# Altium project fNIRS_sensor_module.PrjPcb
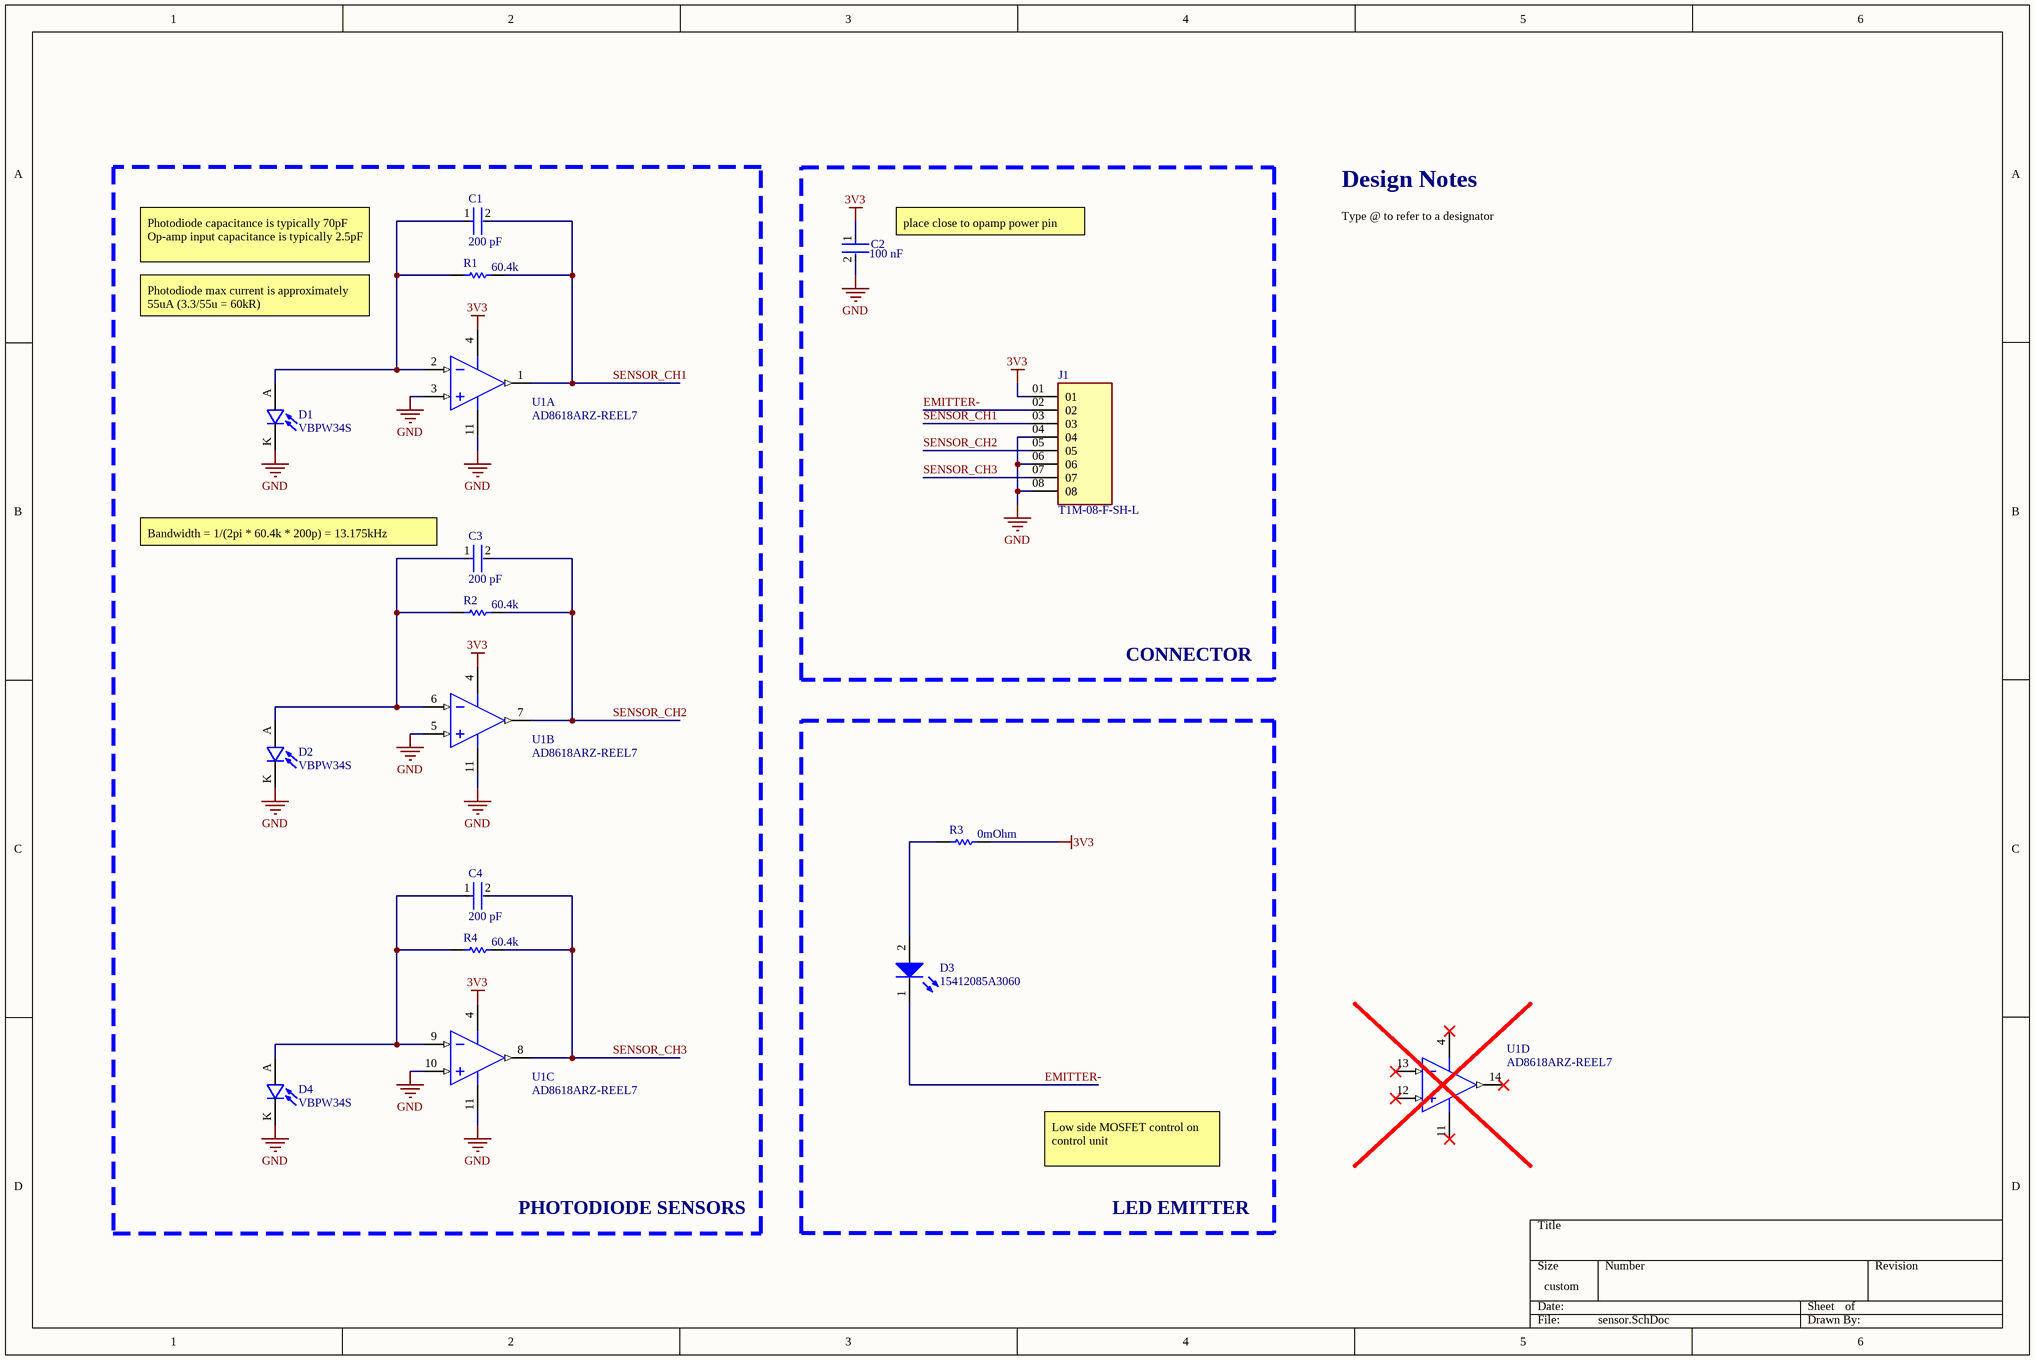
[diagram p0: sensor.SchDoc]
1 sheet, 14 parts. Net scope: global (net labels, ports and power ports of the same name join across sheets).
Board file: SensorModule.PcbDoc

## Sheet sensor.SchDoc
size 381 x 254 mm; SheetNumber: 1; SheetTotal: 1

### Parts
C1  Capacitance: 200 pF  [FP-C0603C-CF-MFG]  (hidden comment: C0603C201J5GACTU)
C2  Capacitance: 100 nF  [FP-CC0603-DA-MFG]  (hidden comment: CC0603KRX7R7BB104)
C3  Capacitance: 200 pF  [FP-C0603C-CF-MFG]  (hidden comment: C0603C201J5GACTU)
C4  Capacitance: 200 pF  [FP-C0603C-CF-MFG]  (hidden comment: C0603C201J5GACTU)
D1  VBPW34S  [XDCR_VBPW34S]
D2  VBPW34S  [XDCR_VBPW34S]
D3  15412085A3060  [WL-SIRW_1206]
D4  VBPW34S  [XDCR_VBPW34S]
J1  T1M-08-F-SH-L  [SAMTEC_T1M-08-F-SH-L]
R1  Resistance: 60.4k  [RESC1608X55X25ML10T15]  (hidden comment: RC0603FR-0760K4L)
R2  Resistance: 60.4k  [RESC1608X55X25ML10T15]  (hidden comment: RC0603FR-0760K4L)
R3  Resistance: 0mOhm  [RESC1608X55X25ML10T15]  (hidden comment: RC0603JR-070RL)
R4  Resistance: 60.4k  [RESC1608X55X25ML10T15]  (hidden comment: RC0603FR-0760K4L)
U1  AD8618ARZ-REEL7  [ADI-R-14_M]  (parts A,B,C,D of 4)

### Blocks framed on the sheet
PHOTODIODE SENSORS: C1 C3 C4 D1 D2 D4 R1 R2 R4 U1
CONNECTOR: C2 J1
LED EMITTER: D3 R3

### Nets
3V3: C2.1 J1.01 R3.2 U1.4(+V)
GND: C2.2 D1.K(C) D2.K(C) D4.K(C) J1.04 J1.06 J1.08 U1.3(+IN_A) U1.5(+IN_B) U1.10(+IN_C) U1.11(-V)
EMITTER-: D3.1(K) J1.02
SENSOR_CH1: C1.2 J1.03 R1.2 U1.1(OUT_A)
SENSOR_CH2: C3.2 J1.05 R2.2 U1.7(OUT_B)
SENSOR_CH3: C4.2 J1.07 R4.2 U1.8(OUT_C)
NetC1_1: C1.1 D1.A R1.1 U1.2(-IN_A)
NetC3_1: C3.1 D2.A R2.1 U1.6(-IN_B)
NetC4_1: C4.1 D4.A R4.1 U1.9(-IN_C)
NetD3_2: D3.2(A) R3.1

Not connected (* = marked no-connect by the designer): U1 12(+IN_D)* 13(-IN_D)* 14(OUT_D)*

### Notes on the sheet
- (near C2) place close to opamp power pin
- Design Notes
- Photodiode capacitance is typically 70pF
  Op-amp input capacitance is typically 2.5pF
- Photodiode max current is approximately 55uA (3.3/55u = 60kR)
- (near C3) Bandwidth = 1/(2pi * 60.4k * 200p) = 13.175kHz
- Type @ to refer to a designator
- Low side MOSFET control on control unit

### Library data of the parts
C1 C3 C4 = CMP-1035-01444-3: CAP CER 200PF 50V 5% NP0 0603; Manufacturer: KEMET; Automotive Grade: Grade 1; Temperature Characteristic: C0G; Temperature Coefficient: 30ppm/°C; Tolerance: 0.05; Material: Ceramic; Temperature Range High: +125°C; Digikey Description: CAP CER 200PF 50V 5% NP0 0603; ComponentLink2Description: Datasheet; Package: C0603C-CF; Value: 200 pF; Mouser Description: Multilayer Ceramic Capacitors MLCC - SMD/SMT 50volts 200pF C0G 5%; Voltage Rating: 50 V; Temperature Range Low: -55°C; Device Class L2: Capacitors; Temperature: -55°C to +125°C; Device Class L1: Passive Components; Device Class L3: Ceramic Capacitors; ComponentLink2URL: https://api.kemet.com/component-edge/download/datasheet/C0603C100J5GACAUTO.pdf; Height: 0.87mm; Automotive: Yes; Octopart: https://octopart.com/c0603c201j5gactu-kemet-9143917; Category: Cap; Manufacturer Part Number: C0603C201J5GACTU; Lead Free: Yes; RoHS: TRUE
C2 = CMP-2000-05002-2: CAP CER 0.1UF 16V X7R 0603; Manufacturer: YAGEO; Tolerance: 0.1; Value: 100 nF; Temperature Coefficient: 15%; Material: Ceramic; Voltage Rating: 16 V; Package: CC0603-DA; ComponentLink2Description: Datasheet; Octopart: https://octopart.com/cc0603krx7r7bb104-yageo-192941; Temperature Range High: +125°C; Digikey Description: CAP CER 0.1UF 16V X7R 0603; Voltage: 16 V; Device Class L2: Capacitors; Height: 0.9mm; Temperature: -55°C to +125°C; Manufacturer Part Number: CC0603KRX7R7BB104; Device Class L1: Passive Components; Device Class L3: Ceramic Capacitors; ComponentLink2URL: http://www.yageo.com/documents/recent/UPY-GPHC_X7R_6.3V-to-50V_18.pdf; Footprint Url: http://www.yageo.com/exep/pages/download/literatures/UPY-C_GEN_24.pdf; RoHS: TRUE; Temperature Range Low: -55°C; Temperature Characteristic: X7R; Lead Free: Yes; Category: Cap; Mouser Description: Multilayer Ceramic Capacitor, CC Series, 0.1 - F, - 10%, X7R, 16 V, 0603 [1608 Metric]; Automotive: No
D1 D2 D4 = VBPW34S: Photodiode 940nm 100ns 130Â° 2-SMD, Gull Wing; MF: Vishay; Price: None; MP: VBPW34S; Value: *; Package: SMD-2 Vishay; SnapEDA_Link: https://www.snapeda.com/parts/VBPW34S/Vishay%20Semiconductor%20Opto%20Division/view-part/139260/?ref=snap; Availability: Unavailable
D3 = CMP-03913-90235590-1: 15412085A3060 WL-SIRW SMT Infrared Reverse mount Waterclear Dome; Viewing Angle: 30°; Max Reverse Voltage (DC): 5V; Peak Wavelength: 850nm; Forward Current: 700mA; Forward Voltage: 1.4V; Peak Reverse Current: 10µA; Length: 3.2mm; Packaging: Tape and Reel; Min Operating Temperature: -40°C; Height: 1.85mm; RoHS: Compliant; Width: 1.6mm; NexarPartId: 90235590; Max Operating Temperature: 85°C; Wavelength: 850nm
J1 = T1M-08-F-SH-L: MF: Samtec Inc.; Price: None; Availability: Unavailable; Package: None; Value: *; MP: T1M-08-F-SH-L
R1 R2 R4 = CMP-2000-04099-1: Manufacturer: Yageo; Part Number: RC0603FR-0760K4L
R3 = CMP-2100-03667-1: Chip Resistor, 0 Ohm, +/- 5%, 0.1 W, -55 to 155 degC, 0603 (1608 Metric), RoHS, Tape and Reel; Manufacturer: Yageo; Temperature Coefficient: 200ppm/degreesC; Voltage Rating: 50V; Power Rating: 100mW; Width: 0.8mm; Max Operating Temperature: 155degC; Tolerance: 5%; Package Reference: 0603; Height: 0.45mm; Depth: 0.8mm; Package Description: 2-Pin Surface Mount Device, Body 1.6 x 0.8 mm; Termination: SMD/SMT; Package Quantity: 5000; Case/Package: 0603; Case Code (Imperial): 0603; Radiation Hardening: No; Number of Pins: 2; Length: 1.6mm; Lead Free: LeadFree; Voltage Rating (DC): 50V; Military Standard: Not; Datasheet URL: http://www.yageo.com/NewPortal/yageodocoutput?fileName=/pdf/R-Chip/PYu-RC_Group_51_RoHS_L_5.pdf; Manufacturer URL: http://www.yageo.com/; Packaging: TapeandReel; Case Code (Metric): 1608; Min Operating Temperature: -55degC; Composition: ThickFilm; RoHSCompliant: true; Contact Plating: Tin; Datasheet Version: Rev. 5, 10/2016; REACH SVHC: NoSVHC
U1 = CMP-0384-00392-1: Quad Channel Wide Bandwidth Operational Amplifier, 24 MHz BW, 12 V/us SR, Industrial, 14-pin SOIC (R-14), Reel; Generic Part Number: AD8618; Manufacturer: Analog Devices; Slew Rate: 12V/us; Small Signal Bandwidth: 24MHz; Amplifiers Per Package: 4; Input Offset Voltage: 23uV; Input Bias Current: 200fA; V Span Max: 6V; Iq/Amp: 2mA; V Span Min: 2.7V; ComponentLink2URL: http://www.analog.com/static/imported-files/data_sheets/AD8615_8616_8618.pdf; ComponentLink1URL: http://www.analog.com/en/index.html; PartNumber: AD8618ARZ-REEL7; Mounting Technology: Surface Mount; PackageReference: R-14; PackageVersion: 060606-A; ComponentLink3URL: http://www.analog.com/static/imported-files/packages/PKG_PDF/SOIC_Narrow%20(R)/R_14.pdf; DatasheetVersion: Rev. E; PackageDescription: 14-Pin Standard Small Outline Package, Body 8.65 x 3.9 mm, Pitch 1.27 mm; ComponentLink2Description: Datasheet; Code_JEDEC: MS-012-AB; ComponentLink3Description: Package Specification; ComponentLink1Description: Manufacturer URL